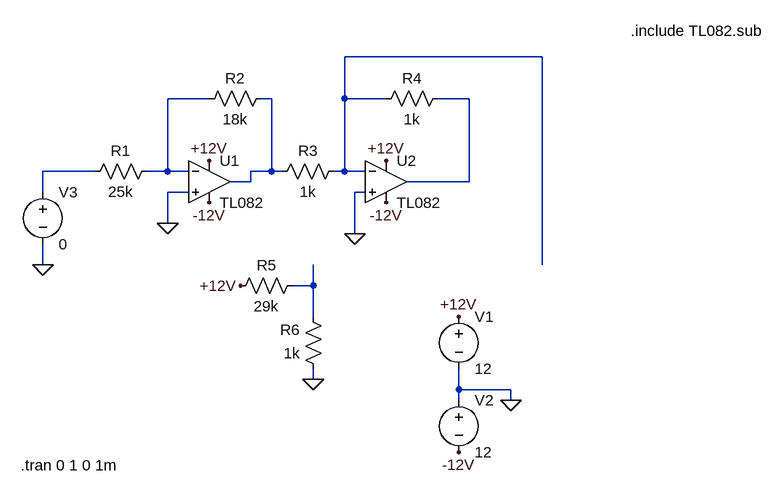
[diagram p0: schematic AdaptacionVi.asc]
AdaptacionVi.asc, the LTspice schematic file:
Version 4
SHEET 1 944 688
WIRE 592 -16 288 -16
WIRE 80 48 16 48
WIRE 176 48 160 48
WIRE 288 48 288 -16
WIRE 352 48 288 48
WIRE 480 48 432 48
WIRE -96 160 -176 160
WIRE 16 160 16 48
WIRE 16 160 -16 160
WIRE 48 160 16 160
WIRE 176 160 176 48
WIRE 176 160 144 160
WIRE 192 160 176 160
WIRE 288 160 288 48
WIRE 288 160 272 160
WIRE 320 160 288 160
WIRE 144 176 144 160
WIRE 144 176 112 176
WIRE 480 176 480 48
WIRE 480 176 384 176
WIRE -176 192 -176 160
WIRE 48 192 16 192
WIRE 320 192 304 192
WIRE 16 240 16 192
WIRE 304 256 304 192
WIRE -176 304 -176 272
WIRE 592 304 592 -16
WIRE 240 336 240 304
WIRE 240 336 208 336
WIRE 240 384 240 336
WIRE 240 480 240 464
WIRE 464 496 464 464
WIRE 544 496 464 496
WIRE 464 512 464 496
WIRE 544 512 544 496
FLAG 544 512 0
FLAG 464 384 +12V
FLAG 352 144 +12V
FLAG 80 144 +12V
FLAG 352 208 -12V
FLAG 80 208 -12V
FLAG 240 480 0
FLAG 128 336 +12V
FLAG -176 304 0
FLAG 16 240 0
FLAG 304 256 0
FLAG 464 592 -12V
SYMBOL Opamps\\opamp2 80 112 R0
SYMATTR InstName U1
SYMATTR Value TL082
SYMBOL Opamps\\opamp2 352 112 R0
SYMATTR InstName U2
SYMATTR Value TL082
SYMBOL voltage 464 368 R0
WINDOW 123 0 0 Left 2
WINDOW 39 0 0 Left 2
SYMATTR InstName V1
SYMATTR Value 12
SYMBOL voltage 464 496 R0
WINDOW 123 0 0 Left 2
WINDOW 39 0 0 Left 2
SYMATTR InstName V2
SYMATTR Value 12
SYMBOL res 0 144 R90
WINDOW 0 0 56 VBottom 2
WINDOW 3 32 56 VTop 2
SYMATTR InstName R1
SYMATTR Value 25k
SYMBOL res 176 32 R90
WINDOW 0 0 56 VBottom 2
WINDOW 3 32 56 VTop 2
SYMATTR InstName R2
SYMATTR Value 18k
SYMBOL res 288 144 R90
WINDOW 0 0 56 VBottom 2
WINDOW 3 32 56 VTop 2
SYMATTR InstName R3
SYMATTR Value 1k
SYMBOL res 448 32 R90
WINDOW 0 0 56 VBottom 2
WINDOW 3 32 56 VTop 2
SYMATTR InstName R4
SYMATTR Value 1k
SYMBOL res 224 320 R90
WINDOW 0 0 56 VBottom 2
WINDOW 3 32 56 VTop 2
SYMATTR InstName R5
SYMATTR Value 29k
SYMBOL res 256 480 R180
WINDOW 0 36 76 Left 2
WINDOW 3 36 40 Left 2
SYMATTR InstName R6
SYMATTR Value 1k
SYMBOL voltage -176 176 R0
WINDOW 123 0 0 Left 2
WINDOW 39 0 0 Left 2
SYMATTR InstName V3
SYMATTR Value 0
TEXT 728 -56 Left 2 !.include TL082.sub
TEXT -210 612 Left 2 !.tran 0 1 0 1m

The netlist it stands for:
* AdaptacionVi.asc
XU1 0 N002 +12V -12V N003 TL082  ; pins In+ In- V+ V- OUT
XU2 0 N001 +12V -12V N004 TL082  ; pins In+ In- V+ V- OUT
V1 +12V 0 12
V2 0 -12V 12
R1 N002 N005 25k
R2 N003 N002 18k
R3 N001 N003 1k
R4 N004 N001 1k
R5 N006 +12V 29k
R6 0 N006 1k
V3 N005 0 0
.include TL082.sub
.tran 0 1 0 1m
.backanno
.end